# EAGLE design sensor1 (EAGLE 8.0.1)
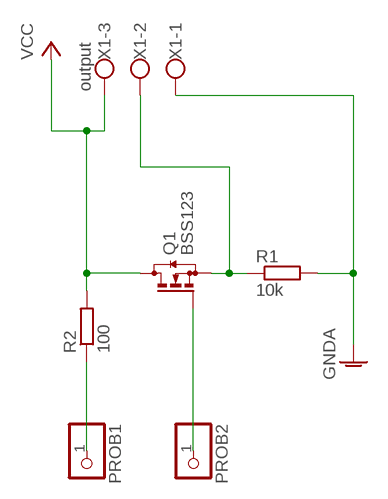
[diagram p0: schematic, sheet 1]

## Parts
PROB1  PINHD-1X1  [1X01]
PROB2  PINHD-1X1  [1X01]
Q1  BSS123  [SOT23]
R1  10k  R-EU_R1206W  [R1206W]
R2  100  R-EU_R1206W  [R1206W]
X1  output  W237-103  [W237-103]

## Nets
GNDA: R1.2 X1.1
N$1: PROB1.1 R2.1
N$2: PROB2.1 Q1.1(G)
N$3: Q1.2(S) R1.1 X1.2
VCC: Q1.3(D) R2.2 X1.3

## Library data of the parts
PROB1 PROB2 = pinhead:PINHD-1X1: PIN HEADER
Q1 = transistor-small-signal:BSS123: N-CHANNEL MOS FET
R1 R2 = rcl:R-EU_: RESISTOR, European symbol
X1 = con-wago-500:W237-103: WAGO SCREW CLAMP; MPN: 237-103; OC_FARNELL: unknown; OC_NEWARK: 18M7116

## Board
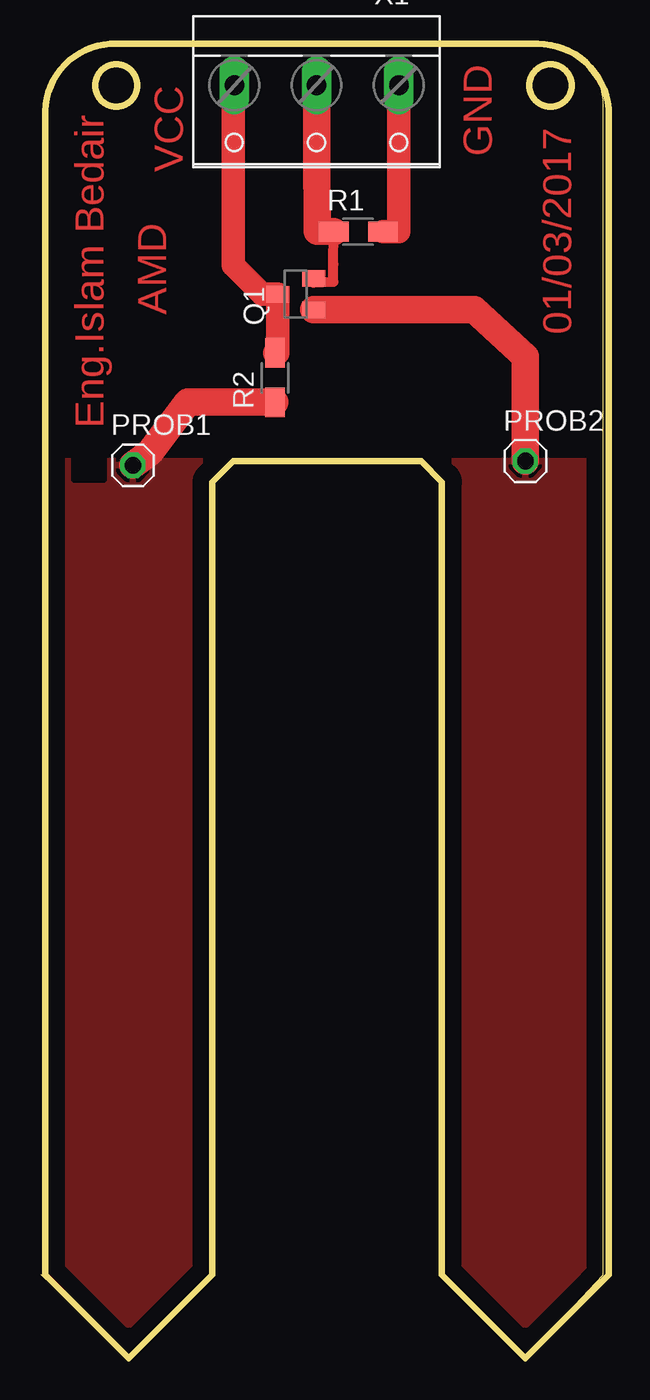
[diagram p1: board, top side]

Size 34.54 x 80.01 mm. Coordinates in mm from the lower left corner, seen from the top.
Outline: 29.46,0 34.21,5.08 34.21,76.26 arc90 30.47,80 4.57,80 arc90 0.25,75.68 0.25,75.93
Outline: 5.33,0 0,5.08
Outline: 0.25,75.93 0.25,5.08 5.33,0
Outline: 0.25,75.93 arc-90 4.59,80.01 30.21,80.01 arc-90 34.54,75.67 34.54,5.08 29.46,0
Outline: 29.46,0 24.38,5.08 24.38,53.34 23.11,54.61 11.68,54.61 10.41,53.34 10.41,5.08 5.33,0
Outline: circle at 4.57,77.47 radius 1.27
Outline: circle at 30.99,77.47 radius 1.27
Copper layers (1*16): Top 0.035mm / dielectric 1.5mm / Bottom 0.035mm
Design rules "default": minimum track width 10mil, minimum drill 24mil, track to track 8mil, track to pad 8mil, pad to pad 8mil, via to via 8mil, smd to smd 8mil, copper to edge 40mil, drill to drill 8mil, minimum pad ring 10mil, minimum via ring 8mil, stop-mask expansion 4mil, vias tented up to drill 0mil, thermal gap 10mil

### Footprints (pad centres in the part's own frame; a part is rotated, then mirrored left to right if it is on the bottom)
1X01 = drill 1.016 octagon: 1 0,0
SOT23 = smd 1 x 1.4: 1 -0.95,-1.1; 2 0.95,-1.1; 3 0,1.1
R1206W = smd 1.8 x 1.2: 1 -1.499,0; 2 1.499,0
W237-103 = drill 1.194 long: 1 -5,-1.29; 2 0,-1.29; 3 5,-1.29

### Placement (x,y rotation side)
PROB1  5.59,54.36 0 top
PROB2  29.46,54.61 0 top
Q1  15.49,64.77 90 top
R1  19.3,68.58 0 top
R2  14.22,59.69 90 top
X1  16.76,76.2 180 top

### Tracks (layer width: path | path; a pad name or v marks a point on that pad's centre or on a via)
GNDA
  Top 1.422: R1.2 21.76,68.58 X1.1
N$1
  Top 1.676: R2.1 8.91,58.19 6.6,55.12 PROB1.1
  pour Top: 5.33,0 0.25,5.08 0.25,54.61 10.41,54.61 10.41,5.08
N$2
  Top 1.676: Q1.1 26.35,63.82 29.46,60.96 PROB2.1
  pour Top: 29.46,0 24.38,5.08 24.38,54.61 34.54,54.61 34.54,5.08
N$3
  Top 0.61: Q1.2 16.58,65.47 17.78,65.53 17.78,66.57 R1.1
  Top 1.676: R1.1 16.79,68.6 16.76,73.66 X1.2
VCC
  Top 1.422: R2.2 14.39,61.19 Q1.3 13.46,64.77 11.68,66.55 11.68,77.41 X1.3

### Text on the board
Top: GND | VCC | Eng.Islam Bedair | 01/03/2017 | AMD